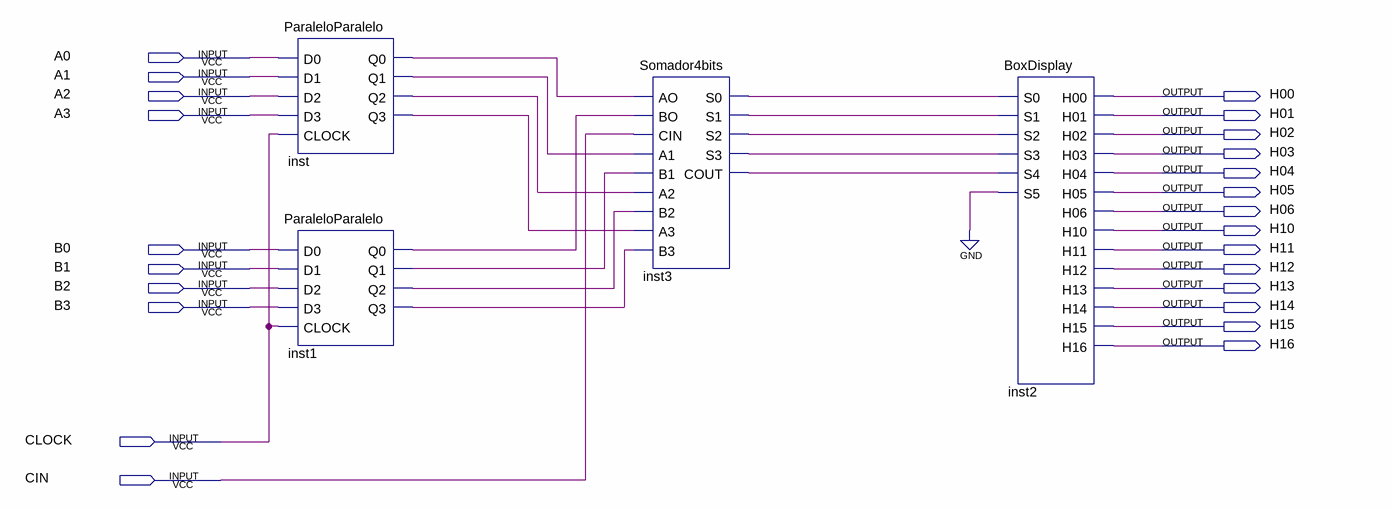
[diagram p0: schematic sheet]
// Quartus schematic RegistradorParalelo.bdf as structural Verilog: 4 symbols, 24 pins
module RegistradorParalelo (
  input  A0,
  input  A1,
  input  A2,
  input  A3,
  input  B0,
  input  B1,
  input  B2,
  input  B3,
  input  CLOCK,
  input  CIN,
  output H00,
  output H01,
  output H02,
  output H03,
  output H04,
  output H05,
  output H06,
  output H10,
  output H11,
  output H12,
  output H13,
  output H14,
  output H15,
  output H16
);

  wire inst1_q0, inst1_q1, inst1_q2, inst1_q3, inst3_cout, inst3_s0, inst3_s1, inst3_s2, inst3_s3, inst_q0,
       inst_q1, inst_q2, inst_q3;

  ParaleloParalelo inst (
    .D0(A0), .D1(A1), .D2(A2), .D3(A3), .CLOCK(CLOCK), .Q0(inst_q0), .Q1(inst_q1), .Q2(inst_q2), .Q3(inst_q3));
  ParaleloParalelo inst1 (
    .D0(B0), .D1(B1), .D2(B2), .D3(B3), .CLOCK(CLOCK), .Q0(inst1_q0), .Q1(inst1_q1), .Q2(inst1_q2),
    .Q3(inst1_q3));
  Somador4bits inst3 (
    .AO(inst_q0), .BO(inst1_q0), .CIN(CIN), .A1(inst_q1), .B1(inst1_q1), .A2(inst_q2), .B2(inst1_q2),
    .A3(inst_q3), .B3(inst1_q3), .S0(inst3_s0), .S1(inst3_s1), .S2(inst3_s2), .S3(inst3_s3), .COUT(inst3_cout));
  BoxDisplay inst2 (
    .S0(inst3_s0), .S1(inst3_s1), .S2(inst3_s2), .S3(inst3_s3), .S4(inst3_cout), .S5(1'b0), .H00(H00),
    .H01(H01), .H02(H02), .H03(H03), .H04(H04), .H05(H05), .H06(H06), .H10(H10), .H11(H11), .H12(H12),
    .H13(H13), .H14(H14), .H15(H15), .H16(H16));
endmodule
